# EAGLE design RPism_adapterboard_0V3 (EAGLE 6.4)
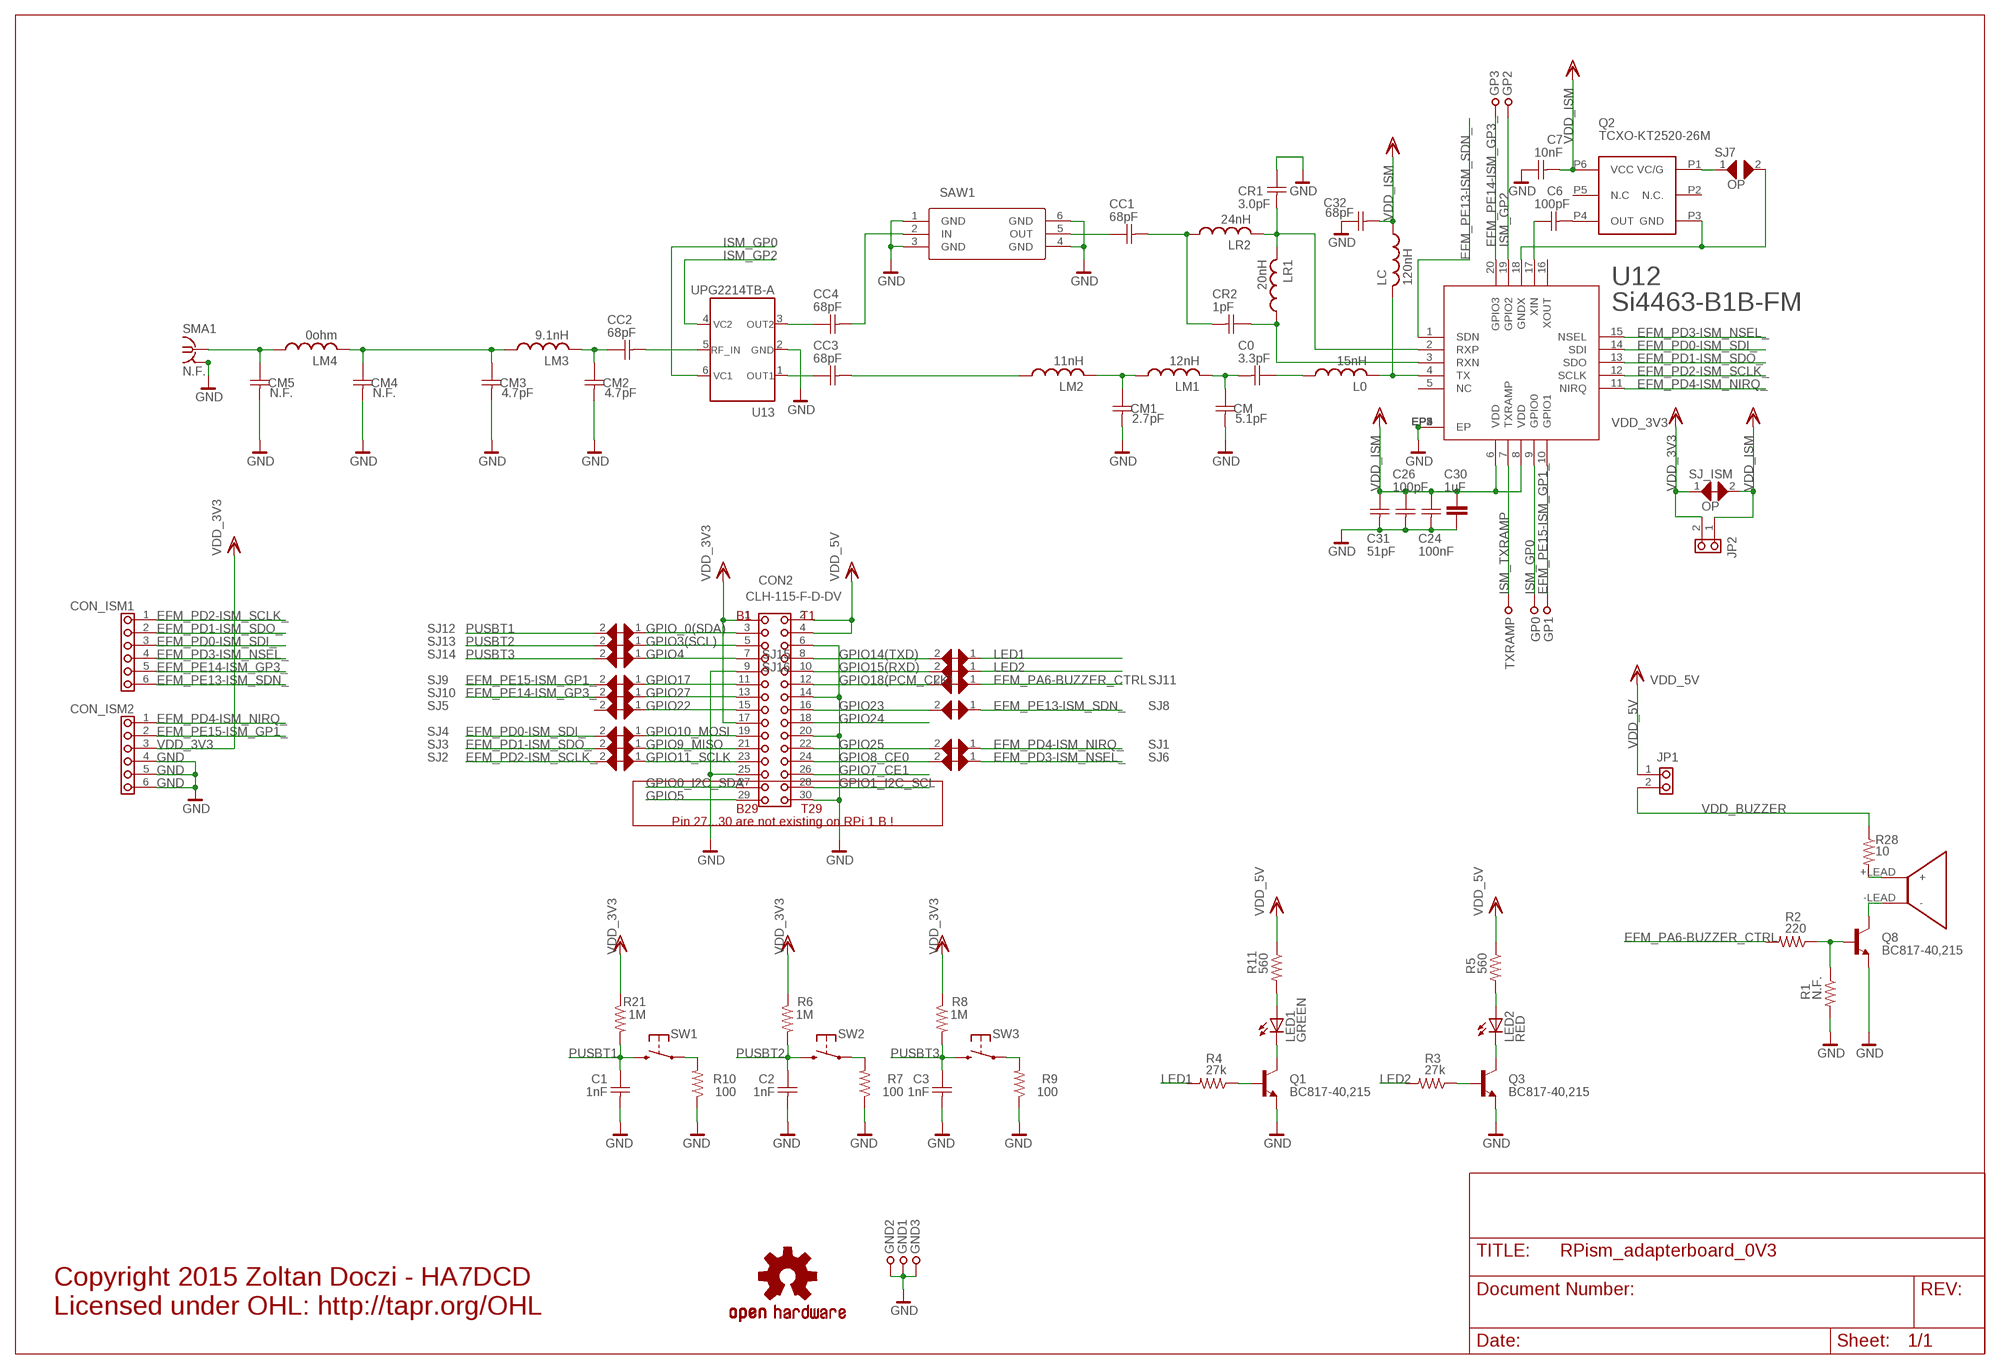
[diagram p0: schematic, sheet 1]

## Parts
BUZZ1  SMT-0540-S-R  [SMT-0540-S-R]
C0  3.3pF  CAP_GRM15  [CAPC1005X60N]
C1  1nF  CAP_GRM15  [CAPC1005X60N]
C2  1nF  CAP_GRM15  [CAPC1005X60N]
C3  1nF  CAP_GRM15  [CAPC1005X60N]
C6  100pF  CAP_GRM15  [CAPC1005X60N]
C7  10nF  CAP_GRM15  [CAPC1005X60N]
C24  100nF  CAP_GRM15  [CAPC1005X60N]
C26  100pF  CAP_GRM15  [CAPC1005X60N]
C30  1uF  CAP-SMD0603  [0603]
C31  51pF  CAP_GRM15  [CAPC1005X60N]
C32  68pF  CAP_GRM15  [CAPC1005X60N]
CC1  68pF  CAP_GRM15  [CAPC1005X60N]
CC2  68pF  CAP_GRM15  [CAPC1005X60N]
CC3  68pF  CAP_GRM15  [CAPC1005X60N]
CC4  68pF  CAP_GRM15  [CAPC1005X60N]
CM  5.1pF  CAP_GRM15  [CAPC1005X60N]
CM1  2.7pF  CAP_GRM15  [CAPC1005X60N]
CM2  4.7pF  CAP_GRM15  [CAPC1005X60N]
CM3  4.7pF  CAP_GRM15  [CAPC1005X60N]
CM4  N.F.  CAP_GRM15  [CAPC1005X60N]
CM5  N.F.  CAP_GRM15  [CAPC1005X60N]
CON2  CLH-115-F-D-DV  PINHD-2X15_SMD2X15  [2X15_SMT_CROSSPCB_ASSYM]
CON_ISM1  MALE__PIN6S-2MM  PIN6S-2MM  [PIN6S_2MM]
CON_ISM2  FEMALE__PIN6S-2MM  PIN6S-2MM  [PIN6S_2MM]
CR1  3.0pF  CAP_GRM15  [CAPC1005X60N]
CR2  1pF  CAP_GRM15  [CAPC1005X60N]
GND1  TESTPOINT39MIL  [TESTPOINT1,0]
GND2  TESTPOINT39MIL  [TESTPOINT1,0]
GND3  TESTPOINT39MIL  [TESTPOINT1,0]
GP0  TESTPOINT20MIL  [TESTPOINT0,5]
GP1  TESTPOINT20MIL  [TESTPOINT0,5]
GP2  TESTPOINT20MIL  [TESTPOINT0,5]
GP3  TESTPOINT20MIL  [TESTPOINT0,5]
JP1  JUMPER2  [PIN2-1R]
JP2  N.F.  JUMPER2  [PIN2-1R]
L0  15nH  INDUCT_SMD  [0402-INDUCT]
LC  120nH  INDUCT_SMD  [0402-INDUCT]
LED1  GREEN  LED0603  [LED-0603]
LED2  RED  LED0603  [LED-0603]
LM1  12nH  INDUCT_SMD  [0402-INDUCT]
LM2  11nH  INDUCT_SMD  [0402-INDUCT]
LM3  9.1nH  INDUCT_SMD  [0402-INDUCT]
LM4  0ohm  INDUCT_SMD  [0402-INDUCT]
LR1  20nH  INDUCT_SMD  [0402-INDUCT]
LR2  24nH  INDUCT_SMD  [0402-INDUCT]
Q1  BC817-40,215  BC817-16LT1SMD  [SOT23-BEC]
Q2  TCXO-KT2520-26M  [TCXO_2.5X2MM]
Q3  BC817-40,215  BC817-16LT1SMD  [SOT23-BEC]
Q8  BC817-40,215  BC817-16LT1SMD  [SOT23-BEC]
R1  N.F.  R-US_R0402  [R0402]
R2  220  R-US_R0402  [R0402]
R3  27k  R-US_R0402  [R0402]
R4  27k  R-US_R0402  [R0402]
R5  560  R-US_R0402  [R0402]
R6  1M  R-US_R0402  [R0402]
R7  100  R-US_R0402  [R0402]
R8  1M  R-US_R0402  [R0402]
R9  100  R-US_R0402  [R0402]
R10  100  R-US_R0402  [R0402]
R11  560  R-US_R0402  [R0402]
R21  1M  R-US_R0402  [R0402]
R28  10  R-US_R0402  [R0402]
SAW1  SAW_EPCOS_B3725  [DCC6C]
SJ1  JUMPER_SMD_MICRO_SHORT  [JUMPER_SMD_MICRO_SHORT]
SJ2  JUMPER_SMD_MICRO_SHORT  [JUMPER_SMD_MICRO_SHORT]
SJ3  JUMPER_SMD_MICRO_SHORT  [JUMPER_SMD_MICRO_SHORT]
SJ4  JUMPER_SMD_MICRO_SHORT  [JUMPER_SMD_MICRO_SHORT]
SJ5  JUMPER_SMD_MICRO_SHORT  [JUMPER_SMD_MICRO_SHORT]
SJ6  JUMPER_SMD_MICRO_SHORT  [JUMPER_SMD_MICRO_SHORT]
SJ7  OP  JUMPER_SMD_MICROOPEN  [JUMPER_SMD_MICRO]
SJ8  JUMPER_SMD_MICRO_SHORT  [JUMPER_SMD_MICRO_SHORT]
SJ9  JUMPER_SMD_MICRO_SHORT  [JUMPER_SMD_MICRO_SHORT]
SJ10  JUMPER_SMD_MICRO_SHORT  [JUMPER_SMD_MICRO_SHORT]
SJ11  JUMPER_SMD_MICRO_SHORT  [JUMPER_SMD_MICRO_SHORT]
SJ12  JUMPER_SMD_MICRO_SHORT  [JUMPER_SMD_MICRO_SHORT]
SJ13  JUMPER_SMD_MICRO_SHORT  [JUMPER_SMD_MICRO_SHORT]
SJ14  JUMPER_SMD_MICRO_SHORT  [JUMPER_SMD_MICRO_SHORT]
SJ15  JUMPER_SMD_MICRO_SHORT  [JUMPER_SMD_MICRO_SHORT]
SJ16  JUMPER_SMD_MICRO_SHORT  [JUMPER_SMD_MICRO_SHORT]
SJ_ISM  OP  JUMPER_SMD_MICRO_SHORT  [JUMPER_SMD_MICRO_SHORT]
SMA1  N.F.  SMAVERTICAL  [BU-SMA-V]
SW1  DTSM_32N  PUSHBUTTON1  [DTSM_32N]
SW2  DTSM_32N  PUSHBUTTON1  [DTSM_32N]
SW3  DTSM_32N  PUSHBUTTON1  [DTSM_32N]
TXRAMP  TESTPOINT20MIL  [TESTPOINT0,5]
U12  Si4463-B1B-FM  SI4463  [QFN-20_PRO2_VERIFIED]
U13  UPG2214TB-A  UPG2214TB6SM  [6-PIN_SUPER_MINIMOLD]
U$15  OSHW-LOGOL  [OSHW-LOGO-L]

## Nets
EFM_PA6-BUZZER_CTRL: R2.2 SJ11.1
EFM_PD0-ISM_SDI_: CON_ISM1.3 SJ4.2 U12.14(SDI)
EFM_PD1-ISM_SDO_: CON_ISM1.2 SJ3.2 U12.13(SDO)
EFM_PD2-ISM_SCLK_: CON_ISM1.1 SJ2.2 U12.12(SCLK)
EFM_PD3-ISM_NSEL_: CON_ISM1.4 SJ6.1 U12.15(NSEL)
EFM_PD4-ISM_NIRQ_: CON_ISM2.1 SJ1.1 U12.11(NIRQ)
EFM_PE13-ISM_SDN_: CON_ISM1.6 SJ8.1 U12.1(SDN)
EFM_PE14-ISM_GP3_: CON_ISM1.5 GP3.1 SJ10.2 U12.20(GPIO3)
EFM_PE15-ISM_GP1_: CON_ISM2.2 GP1.1 SJ9.2 U12.10(GPIO1)
GND: C1.2(C2) C2.2(C2) C3.2(C2) C7.1(C1) C24.2(C2) C26.2(C2) C30.1 C31.2(C2) C32.1(C1) CM1.2(C2) CM2.2(C2) CM3.2(C2) CM4.2(C2) CM5.2(C2) CM.2(C2) CON2.6 CON2.9 CON2.14 CON2.20 CON2.25 CON2.30 CON_ISM2.4 CON_ISM2.5 CON_ISM2.6 CR1.1(C1) GND1.1 GND2.1 GND3.1 Q1.E Q3.E Q8.E R1.2 R7.1 R9.1 R10.1 SAW1.1(GND) SAW1.3(GND) SAW1.4(GND) SAW1.6(GND) SMA1.2 SMA1.3 SMA1.4 SMA1.5 U12.EP0(EP) U12.EP1(EP) U12.EP2(EP) U12.EP3(EP) U12.EP4(EP) U12.EP5(EP) U13.2
GPIO0_I2C_SDA: CON2.27
GPIO1_I2C_SCL: CON2.28
GPIO3(SCL): CON2.5 SJ13.1
GPIO4: CON2.7 SJ14.1
GPIO5: CON2.29
GPIO7_CE1: CON2.26
GPIO8_CE0: CON2.24 SJ6.2
GPIO9_MISO: CON2.21 SJ3.1
GPIO10_MOSI: CON2.19 SJ4.1
GPIO11_SCLK: CON2.23 SJ2.1
GPIO14(TXD): CON2.8 SJ15.2
GPIO15(RXD): CON2.10 SJ16.2
GPIO17: CON2.11 SJ9.1
GPIO18(PCM_CLK): CON2.12 SJ11.2
GPIO22: CON2.15 SJ5.1
GPIO23: CON2.16 SJ8.2
GPIO24: CON2.18
GPIO25: CON2.22 SJ1.2
GPIO27: CON2.13 SJ10.1
GPIO_0(SDA): CON2.3 SJ12.1
ISM_GP0: GP0.1 U12.9(GPIO0) U13.6
ISM_GP2: GP2.1 U12.19(GPIO2) U13.4
ISM_TXRAMP: TXRAMP.1 U12.7(TXRAMP)
LED1: R4.2 SJ15.1
LED2: R3.2 SJ16.1
N$1: Q1.B R4.1
N$2: LED1.C Q1.C
N$3: LED1.A R11.2
N$4: LED2.C Q3.C
N$5: LED2.A R5.2
N$6: Q3.B R3.1
N$7: R7.2 SW2.1
N$8: C6.1(C1) U12.17(XIN)
N$9: R9.2 SW3.1
N$13: C6.2(C2) Q2.P4(OUT)
N$19: R10.2 SW1.1
N$45: BUZZ1.+LEAD(+) R28.2
N$46: BUZZ1.-LEAD(-) Q8.C
N$52: Q8.B R1.1 R2.1
N$60: CC1.1(C1) SAW1.5(OUT)
N$62: Q2.P1(VC/G) SJ7.1
N$63: L0.2 LC.2 U12.4(TX)
N$64: C0.1(C1) L0.1
N$65: C0.2(C2) CM.1(C1) LM1.2
N$66: CM1.1(C1) LM1.1 LM2.2
N$67: CC3.2(C2) LM2.1
N$68: CC3.1(C1) U13.1
N$70: CC2.2(C2) U13.5
N$71: CR2.1(C1) LR1.1 U12.3(RXN)
N$72: CR1.2(C2) LR1.2 LR2.2 U12.2(RXP)
N$75: Q2.P3(GND) SJ7.2 U12.18(GNDX)
N$76: CC1.2(C2) CR2.2(C2) LR2.1
N$78: CC4.2(C2) SAW1.2(IN)
N$79: CC4.1(C1) U13.3
PUSBT1: C1.1(C1) R21.2 SJ12.2 SW1.2
PUSBT2: C2.1(C1) R6.2 SJ13.2 SW2.2
PUSBT3: C3.1(C1) R8.2 SJ14.2 SW3.2
RF3: CM5.1(C1) LM4.1 SMA1.1
RF10: CC2.1(C1) CM2.1(C1) LM3.2
RF12: CM3.1(C1) CM4.1(C1) LM3.1 LM4.2
VDD_3V3: CON2.1 CON2.17 CON_ISM2.3 JP2.2(B) R6.1 R8.1 R21.1 SJ_ISM.1
VDD_5V: CON2.2 CON2.4 JP1.1(A) R5.1 R11.1
VDD_BUZZER: JP1.2(B) R28.1
VDD_ISM: C7.2(C2) C24.1(C1) C26.1(C1) C30.2 C31.1(C1) C32.2(C2) JP2.1(A) LC.1 Q2.P6(VCC) SJ_ISM.2 U12.6(VDD) U12.8(VDD)
Unconnected: Q2.P2(N.C.) Q2.P5(N.C) SJ5.2 U12.5(NC) U12.16(XOUT)

## Notes on the sheet
- Pin 27...30 are not existing on RPi 1 B !
- Copyright 2015 Zoltan Doczi - HA7DCD
  Licensed under OHL: http://tapr.org/OHL

## Library data of the parts
BUZZ1 = dzo:SMT-0540-S-R: BUZZER MAGNETIC 3V 5MM SMD; DISTRI: Digikey; DISTRINR: 668-1060-1-ND; PARTNR: PUI Audio, Inc.
C0 C1-C3 C6 C7 C24 C26 C31 C32 CC1-CC4 CM CM1-CM5 CR1 CR2 = dzo:CAP_GRM15: Murata GRM15 series 0402 size capacitor; MURATA: GRM15 series
C30 = lve_modositott:CAP-SMD
CON2 = dzo:PINHD-2X15_SMD: SAMTEC CLH-115-F-D-DV Board-To-Board Connector, CLH Series, Surface Mount, Receptacle, 30, 2.54 mm, Gold Plated Contacts; DISTRI: Farnell; DISTRINR: 1930662; PARTNR: CLH-115-F-D-DV
CON_ISM1 CON_ISM2 = dzo:PIN6S
GND1-GND3 = lve_modositott:TESTPOINT
GP0 GP1-GP3 TXRAMP = dzo:TESTPOINT
JP1 JP2 = dzo:JUMPER2
L0 = dzo:INDUCT_SMD: smd inductor; PARTNR: LQW15AN15NJ00; VENDOR: Murata
LC = dzo:INDUCT_SMD: smd inductor; PARTNR: LQW15ANR12J00; VENDOR: Murata
LED1 LED2 = dzo:LED: LEDs Standard schematic elements and footprints for 5mm, 3mm, 1206, and 0603 sized LEDs. 5mm - Spark Fun Electronics SKU : COM-00529 (and others)
LM1 LM4 = dzo:INDUCT_SMD: smd inductor; PARTNR: LQW15AN12NJ00; VENDOR: Murata
LM2 = dzo:INDUCT_SMD: smd inductor; PARTNR: LQW15AN11NJ00; VENDOR: Murata
LM3 = dzo:INDUCT_SMD: smd inductor; PARTNR: LQW15AN9N1J00; VENDOR: Murata
LR1 = dzo:INDUCT_SMD: smd inductor; PARTNR: LQW15AN20NJ00D; VENDOR: Murata
LR2 = dzo:INDUCT_SMD: smd inductor; PARTNR: LQW15AN24NJ00D; VENDOR: Murata
Q1 Q3 Q8 = transistor-npn:BC817*: NPN Transistor
Q2 = dzo:TCXO-KT2520-26M: Temperature Compensated Crystal Oscillators (TCXO) Surface Mount Type TCXO (LSI Type) KT2520 Series; DISTRI: Mouser; DISTRINR: 581-KT2520F26ACW18T; PARTNR: KT2520F26000ACW18TAN; VENDOR: AVX-Kyocera
R1-R11 R21 R28 = resistor:R-US_: RESISTOR, American symbol
SAW1 = dzo:SAW_EPCOS_B3725: 869MHz, BW=2MHz SAW filter; DISTRI: Mouser; DISTRINR: 871-B39871B3725U410; PARTNR: B39871B3725U410; VENDOR: Epcos
SJ1-SJ6 SJ8-SJ16 SJ_ISM = dzo:JUMPER_SMD_MICRO_SHORT
SJ7 = dzo:JUMPER_SMD_MICRO
SMA1 = dzo:SMA
SW1-SW3 = dzo:PUSHBUTTON1
U12 = dzo:SI4463: Sub GHz band RF Transceiver; DISTRI: Mouser; DISTRINR: 634-SI4463-B1B-FM; PARTNR: Si4463-B1B-FM; VENDOR: Silicon Labs
U13 = dzo:UPG2214TB: GaAs Integrated Circuit for L, S-Band SPDT Switch; DISTRI: Mouser; DISTRINR: 551-UPG2214TB-A; PARTNR: UPG2214TB-A; VENDOR: CEL
U$15 = Pinoccio:OSHW-LOGO: Open Source Hardware Logo This logo indicates the piece of hardware it is found on incorporates a OSHW license and/or adheres to the definition of open source hardware found here: http://freedomdefined.org/OSHW

## Board
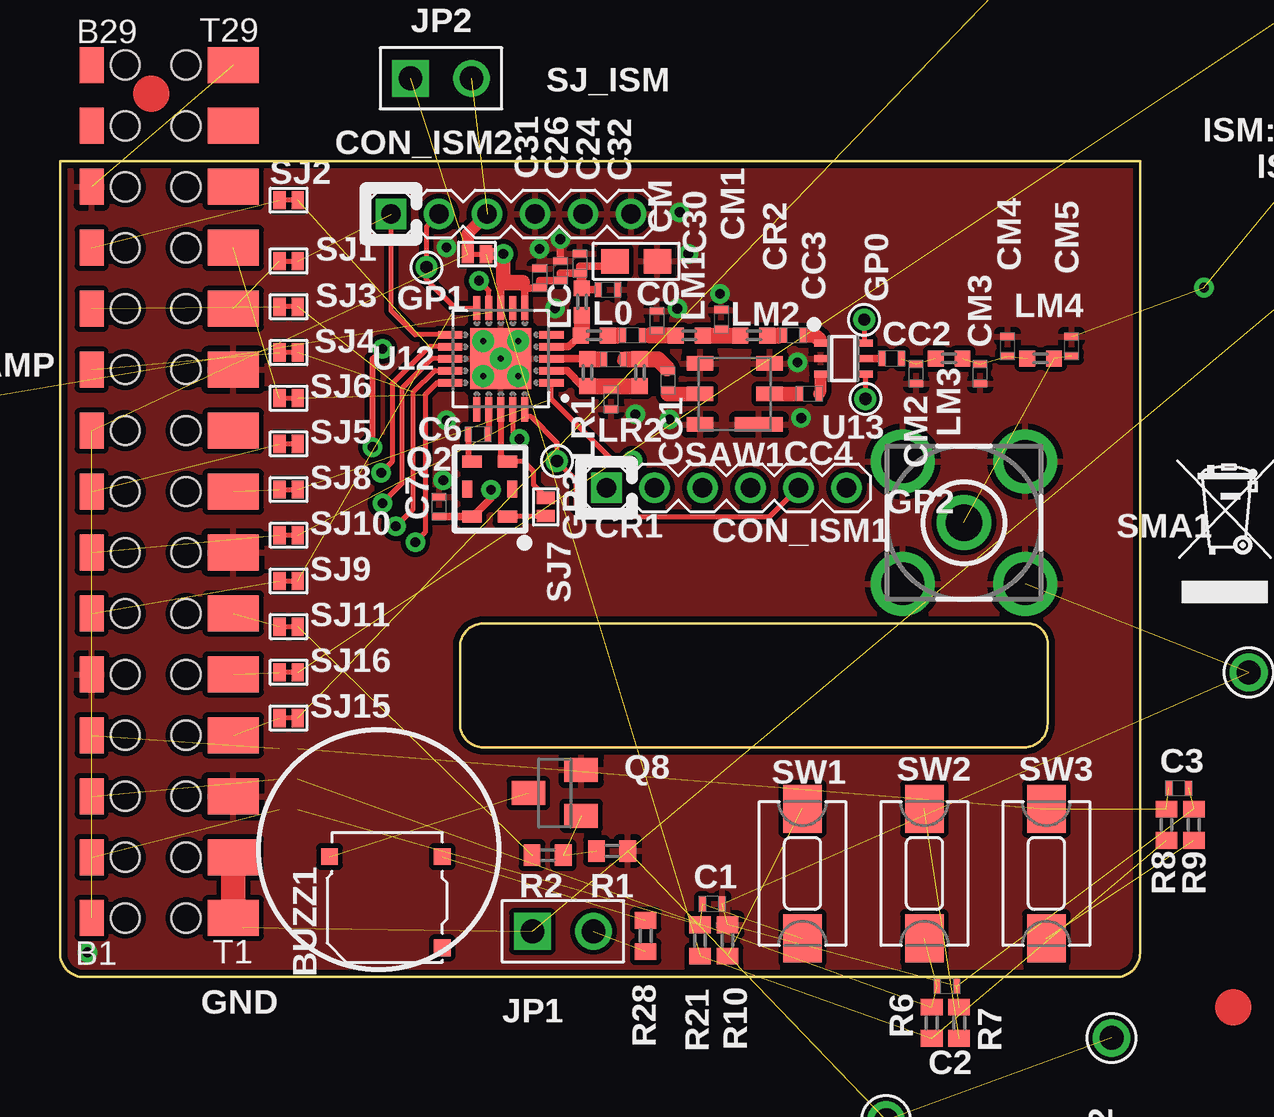
[diagram p1: board, top side]
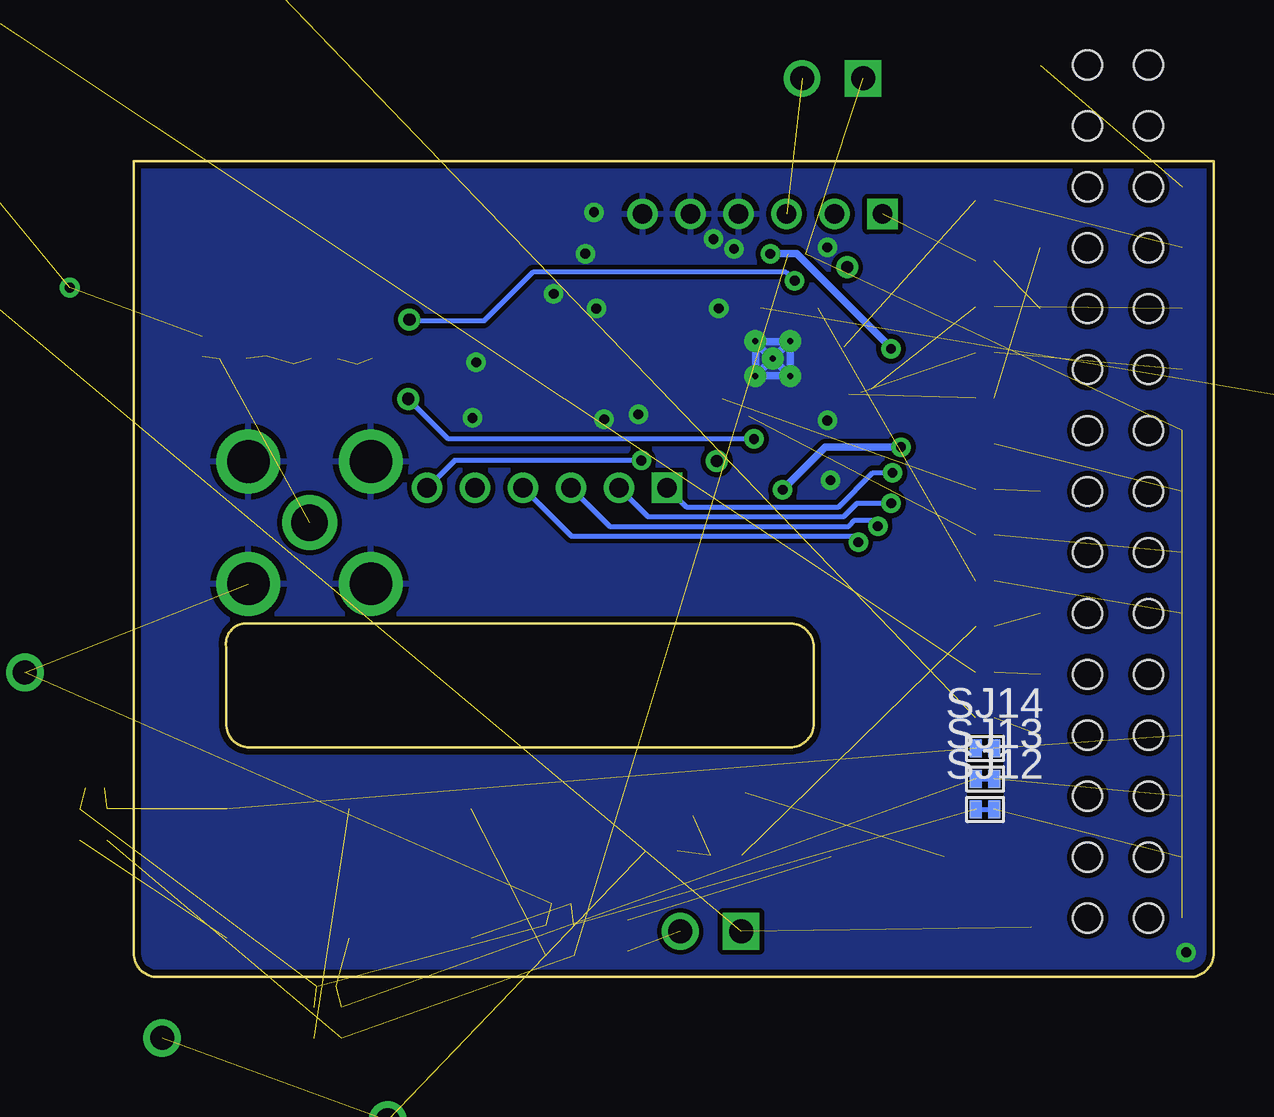
[diagram p2: board, bottom side, seen from below]

Size 45 x 34 mm. Coordinates in mm from the lower left corner, seen from the top.
Outline: 40,34 0,34 0,1 arc90 1,0 44,0 arc90 45,1 45,34 40,34
Outline: 17.65,14.74 40.42,14.74 arc-90 41.15,13.76 41.15,10.55 arc-90 40.17,9.57 17.65,9.57 arc-90 16.67,10.55 16.67,13.76 arc-90 17.65,14.74
Copper layers (1*16): Top 0.0356mm / dielectric 1.5mm / Bottom 0.0356mm
Design rules "default_INTEGRATION *": minimum track width 6mil, minimum drill 9mil, track to track 8mil, track to pad 6mil, pad to pad 6mil, via to via 8mil, smd to smd 0mil, copper to edge 10mil, drill to drill 8mil, minimum pad ring 7mil, minimum via ring 8mil, stop-mask expansion 0mil, vias tented up to drill 24mil, thermal gap 10mil

### Footprints (pad centres in the part's own frame; a part is rotated, then mirrored left to right if it is on the bottom)
SMT-0540-S-R = smd 0.7 x 0.7: +LEAD 0,0; -LEAD 0,4.7; DUMMY -3.8,0
CAPC1005X60N = smd 0.305 x 0.61: 1 -0.406,0; 2 0.406,0
0603 = smd 1.143 x 1.016: 1 -0.889,0; 2 0.889,0
2X15_SMT_CROSSPCB_ASSYM = smd 1.5 x 1: 1 -15.21,2.7; 3 -12.67,2.7; 5 -10.13,2.7; 7 -7.59,2.7; 9 -5.05,2.7; 11 -2.51,2.7; 13 0.03,2.7; 15 2.57,2.7; 17 5.11,2.7; 19 7.65,2.7; 21 10.19,2.7; 23 12.73,2.7; 25 15.27,2.7; 27 17.81,2.7; 29 20.35,2.7 | smd 1.5 x 2.13: 2 -15.21,-3.205; 4 -12.67,-3.205; 6 -10.13,-3.205; 8 -7.59,-3.205; 10 -5.05,-3.205; 12 -2.51,-3.205; 14 0.03,-3.205; 16 2.57,-3.205; 18 5.11,-3.205; 20 7.65,-3.205; 22 10.19,-3.205; 24 12.73,-3.205; 26 15.27,-3.205; 28 17.81,-3.205; 30 20.35,-3.205 | hole 1.2: -15.21,1.3; -12.67,1.3; -10.13,1.3; -7.59,1.3; -5.05,1.3; -2.51,1.3; 0.03,1.3; -15.21,-1.24; -12.67,-1.24; -10.13,-1.24; -7.59,-1.24; -5.05,-1.24; -2.51,-1.24; 0.03,-1.24; 2.57,-1.24; 5.11,-1.24; 2.57,1.3; 5.11,1.3; 7.65,-1.24; 10.19,-1.24; 12.73,-1.24; 15.27,-1.24; 17.81,-1.24; 20.35,-1.24; 7.65,1.3; 10.19,1.3; 12.73,1.3; 15.27,1.3; 17.81,1.3; 20.35,1.3
PIN6S_2MM = drill 0.813 pad 1.27 square: 1 0,0 | drill 0.813 pad 1.27: 2 2,0; 3 4,0; 4 6,0; 5 8,0; 6 10,0
TESTPOINT1,0 = drill 1 pad 1.575: 1 0,0
TESTPOINT0,5 = drill 0.508 pad 0.914: 1 0,0
PIN2-1R = drill 0.991 pad 1.524 square: 1 0,0 | drill 0.991 pad 1.524: 2 2.54,0
0402-INDUCT = smd 0.66 x 0.66: 1 -0.539,0; 2 0.579,0
LED-0603 = smd 0.8 x 0.8: A 0,-0.8; C 0,0.8
SOT23-BEC = smd 1 x 1.4: B -0.95,-1.1; C 0,1.1; E 0.95,-1.1
TCXO_2.5X2MM = smd 0.5 x 0.825: P1 -1.15,-0.738; P3 1.15,-0.738; P4 1.15,0.738; P6 -1.15,0.738 | smd 0.7 x 0.43: P2 0,-0.935; P5 0,0.935
R0402 = smd 0.7 x 0.9: 1 -0.65,0; 2 0.65,0
DCC6C = smd 0.6 x 2: 1 -1.27,-1 | smd 0.6 x 1.1: 2 0,-1.45; 3 1.27,-1.45; 4 1.27,1.45; 5 0,1.45; 6 -1.27,1.45
JUMPER_SMD_MICRO_SHORT = smd 0.508 x 0.762: 1 -0.381,0; 2 0.381,0
JUMPER_SMD_MICRO = smd 0.508 x 0.762: 1 -0.381,0; 2 0.381,0
BU-SMA-V = drill 1.524 pad 2.286: 1 0,0 | drill 1.778 pad 2.667: 2 -2.55,2.55; 3 2.55,2.55; 4 2.55,-2.55; 5 -2.55,-2.55
DTSM_32N = smd 2 x 1.6: 1 -2.7,0; 2 2.7,0
QFN-20_PRO2_VERIFIED = smd 1.016 x 0.305: 1 -2.108,1; 2 -2.108,0.5; 3 -2.108,0; 4 -2.108,-0.5; 5 -2.108,-1; 11 2.108,-1; 12 2.108,-0.5; 13 2.108,0; 14 2.108,0.5; 15 2.108,1 | smd 0.305 x 1.016: 6 -1,-2.108; 7 -0.5,-2.108; 8 0,-2.108; 9 0.5,-2.108; 10 1,-2.108; 16 1,2.108; 17 0.5,2.108; 18 0,2.108; 19 -0.5,2.108; 20 -1,2.108 | smd 2.55 x 2.55: EP0 0,0 | drill 0.25 pad 0.914: EP1 -0.723,0.727; EP2 0.727,0.727; EP3 -0.727,-0.727; EP4 0.727,-0.727; EP5 0,0
6-PIN_SUPER_MINIMOLD = smd 0.55 x 0.3: 1 -0.948,0.65; 2 -0.948,0; 3 -0.948,-0.65; 4 0.948,-0.65; 5 0.948,0; 6 0.948,0.65

### Placement (x,y rotation side)
BUZZ1  15.93,5.02 90 top
C0  23.85,26.74 0 top
C1  27.18,3.05 0 top
C2  36.96,-0.38 0 top
C3  46.61,7.87 0 top
C6  17.42,22.63 180 top
C7  15.8,19.6 270 top
C24  21.67,29.74 90 top
C26  20.85,29.43 90 top
C30  24.01,29.84 180 top
C31  19.99,29.13 90 top
C32  22.84,28.65 180 top
CC1  25.33,24.86 90 top
CC2  34.66,25.78 180 top
CC3  30.56,26.74 180 top
CC4  31.22,24.3 180 top
CM  24.87,27.35 90 top
CM1  27.56,27.4 90 top
CM2  35.67,25.15 270 top
CM3  38.34,25.15 270 top
CM4  39.48,26.29 90 top
CM5  42.15,26.29 90 top
CON2  4.01,17.67 90 top
CON_ISM1  22.77,20.39 0 top
CON_ISM2  13.79,31.81 0 top
CR1  22.96,24.08 90 top
CR2  23.07,25.75 0 top
GND1  34.42,-5.97 90 top  (outside the outline)
GND2  43.81,-2.54 0 top
GND3  49.53,12.7 180 top  (outside the outline)
GP0  33.51,27.4 90 top
GP1  15.27,29.59 180 top
GP2  33.56,24.1 0 top
GP3  20.71,21.51 0 top
JP1  19.68,1.91 0 top
JP2  14.61,37.47 0 top  (outside the outline)
L0  22.28,26.74 180 top
LC  21.74,28.17 270 top
LED1  56.8,57.23 0 top  (outside the outline)
LED2  64.42,43.27 0 top  (outside the outline)
LM1  26.24,26.74 180 top
LM2  28.93,26.74 180 top
LM3  37.07,25.78 180 top
LM4  40.88,25.78 180 top
LR1  21.97,25.22 270 top
LR2  24.16,25.22 270 top
Q1  56.87,62.15 180 top  (outside the outline)
Q2  17.91,20.34 90 top
Q3  59.34,45.17 0 top  (outside the outline)
Q8  20.61,7.67 90 top
R1  23,5.25 0 top
R2  20.32,5.08 180 top
R3  56.23,43.09 180 top  (outside the outline)
R4  59.98,63.59 0 top  (outside the outline)
R5  64.69,40.29 90 top  (outside the outline)
R6  36.32,-1.91 90 top
R7  37.47,-1.91 270 top
R8  46.1,6.35 90 top
R9  47.24,6.35 270 top
R10  27.81,1.52 270 top
R11  58.7,55.33 0 top  (outside the outline)
R21  26.67,1.52 90 top
R28  24.4,1.71 90 top
SAW1  28.12,24.3 90 top
SJ1  9.53,29.84 0 top
SJ2  9.53,32.38 180 top
SJ3  9.53,27.94 180 top
SJ4  9.53,26.04 180 top
SJ5  9.53,22.23 180 top
SJ6  9.53,24.13 0 top
SJ7  20.24,19.6 90 top
SJ8  9.53,20.32 0 top
SJ9  9.53,16.51 0 top
SJ10  9.53,18.41 0 top
SJ11  9.53,14.61 0 top
SJ12  9.53,6.99 0 bottom
SJ13  9.53,8.26 0 bottom
SJ14  9.53,9.53 0 bottom
SJ15  9.53,10.79 180 top
SJ16  9.53,12.7 180 top
SJ_ISM  17.37,30.13 0 top
SMA1  37.67,18.94 0 top
SW1  30.94,4.32 270 top
SW2  36.02,4.32 270 top
SW3  41.1,4.32 90 top
TXRAMP  -5.68,23.75 0 top  (outside the outline)
U12  18.37,25.77 180 top
U13  32.64,25.78 0 top
U$1  [FIDUCIAL]  54.31,29.26 0 top  (outside the outline)
U$15  40.01,-20.32 0 top  (outside the outline)
U$115  [FIDUCIAL]  3.81,36.83 0 top
U$116  [FIDUCIAL]  48.9,-1.27 0 top  (outside the outline)
U$142  [NON-DISPOSABLE]  48.57,19.48 0 top  (outside the outline)
U$143  [ROHS_CHINA]  56.7,21.34 0 top  (outside the outline)

### Tracks (layer width: path | path; a pad name or v marks a point on that pad's centre or on a via)
EFM_PA6-BUZZER_CTRL  (1 unrouted)
EFM_PD0-ISM_SDI_  (via drill 0.41)  (1 unrouted)
  Top 0.203: U12.14 16.25,25.29 15.62,25.29 14.7,24.38 14.7,19.5 v13.99,18.79
  Bottom 0.203: v13.99,18.79 14.25,19.04 14.96,19.04 15.21,18.79 25.16,18.79 CON_ISM1.3
EFM_PD1-ISM_SDO_  (via drill 0.41)  (1 unrouted)
  Top 0.203: U12.13 15.49,25.77 14.25,24.53 14.25,20.57 v13.43,19.75
  Bottom 0.203: v13.43,19.75 14.86,19.75 15.41,19.19 23.57,19.19 CON_ISM1.2
EFM_PD2-ISM_SCLK_  (via drill 0.41)  (1 unrouted)
  Top 0.203: U12.12 15.38,26.27 13.84,24.73 13.84,21.48 v13.38,21.02
  Bottom 0.203: v13.38,21.02 14.2,21.02 15.62,19.6 21.98,19.6 CON_ISM1.1
EFM_PD3-ISM_NSEL_  (via drill 0.41)  (1 unrouted)
  Top 0.203: U12.15 15.71,24.77 15.21,24.27 15.21,18.53 v14.81,18.13
  Bottom 0.203: v14.81,18.13 15.06,18.38 26.76,18.38 CON_ISM1.4
EFM_PD4-ISM_NIRQ_  (1 unrouted)
  Top 0.203: U12.11 14.79,26.77 13.79,27.77 CON_ISM2.1
EFM_PE13-ISM_SDN_  (via drill 0.41)  (1 unrouted)
  Top 0.203: 20.47,24.77 U12.1 20.48,24.09 23.04,21.53 v23.85,21.53
  Bottom 0.203: v23.85,21.53 31.63,21.53 CON_ISM1.6
EFM_PE14-ISM_GP3_  (1 unrouted)
  Top 0.203: U12.20 19.37,23.36 19.63,23.36 20.71,22.28 GP3.1 21.52,20.7 21.52,19.59 21.92,19.19 29.57,19.19 CON_ISM1.5
EFM_PE15-ISM_GP1_  (1 unrouted)
  Top 0.203: U12.10 16.47,27.88 15.27,29.08 GP1.1 15.27,31.28 CON_ISM2.2
GND  (via drill 0.41)  (13 unrouted)
  Top 0.305: C26.2 20.85,30.55 v20.84,30.76
  Bottom 0.305: U12.EP2 17.64,26.46 17.6,26.5 17.65,26.5 | 17.65,26.5 19.08,26.5 19.08,25.07 17.67,25.07 | 17.6,25.07 17.67,25.07 | 17.67,25.07 U12.EP0 18.4,25.77 19.13,26.5 | U12.EP1 17.65,26.5
  other vias: 1.14,1.03 15.97,20.7 26.18,30.15 19.98,30.35 25.72,27.86 27.5,28.47 30.73,25.63 20.62,27.87 47.66,28.74 16.1,30.41 16.1,23.2 23.97,23.45 30.88,23.3 25.4,23.25 25.82,31.88
  pour Top (rank 2): 45,34 45,0 0.01,0 0,34
  pour Bottom (rank 2): 45,34 45,0 0.01,0 0,34
GPIO3(SCL)  (1 unrouted)
GPIO4  (1 unrouted)
GPIO8_CE0  (1 unrouted)
GPIO9_MISO  (1 unrouted)
GPIO10_MOSI  (1 unrouted)
GPIO11_SCLK  (1 unrouted)
GPIO14(TXD)  (1 unrouted)
GPIO15(RXD)  (1 unrouted)
GPIO17  (1 unrouted)
GPIO18(PCM_CLK)  (1 unrouted)
GPIO22  (1 unrouted)
GPIO23  (1 unrouted)
GPIO25  (1 unrouted)
GPIO27  (1 unrouted)
GPIO_0(SDA)  (1 unrouted)
ISM_GP0  (via drill 0.41)
  Top 0.203: GP0.1 33.51,26.51 U13.6 | U12.9 17.87,28.61 v17.45,29.03
  Bottom 0.203: v17.45,29.03 17.81,29.38 28.38,29.38 30.41,27.35 33.41,27.35 GP0.1
ISM_GP2  (via drill 0.41)
  Top 0.203: U12.19 18.87,22.7 v19.15,22.43 | U13.4 33.57,25.12 33.57,24.3 33.56,24.29 GP2.1
  Bottom 0.203: v19.15,22.43 31.89,22.43 GP2.1
ISM_TXRAMP  (1 unrouted)
LED1  (1 unrouted)
LED2  (1 unrouted)
N$1  (1 unrouted)
N$2  (1 unrouted)
N$3  (1 unrouted)
N$4  (1 unrouted)
N$5  (1 unrouted)
N$6  (1 unrouted)
N$7  (1 unrouted)
N$8
  Top 0.254: U12.17 17.87,22.67 C6.1
N$9  (1 unrouted)
N$13
  Top 0.254: C6.2 17.01,21.65 Q2.P4
N$19  (1 unrouted)
N$45  (1 unrouted)
N$46  (1 unrouted)
N$52  (2 unrouted)
N$60
  Top 0.305: 25.85,24.3 25.48,24.3 CC1.1
  Top 0.61: SAW1.5 25.32,24.3 25.85,24.3
N$62
  Top 0.203: SJ7.1 19.96,19.19 Q2.P1
N$63
  Top 0.305: U12.4 21.18,26.27 L0.2
  Top 0.66: LC.2 21.75,26.8 L0.2
N$64
  Top 0.305: 23.26,26.74 23.21,26.79 C0.1
  Top 0.66: L0.1 23.01,26.74 23.26,26.74
N$65
  Top 0.305: C0.2 24.51,26.84 CM.1 24.77,26.79 24.58,26.74
  Top 0.66: LM1.2 25.45,26.74 24.58,26.74
N$66
  Top 0.305: LM1.1 27.31,26.79 CM1.1
  Top 0.66: LM1.1 LM2.2
N$67
  Top 0.305: CC3.2 29.66,26.74
  Top 0.66: LM2.1 29.66,26.74 29.97,26.74
N$68
  Top 0.305: CC3.1 30.98,26.79 31.14,26.74 | U13.1 31.79,26.49 31.44,26.74
  Top 0.61: 31.14,26.74 31.44,26.74 31.64,26.59
N$70
  Top 0.305: U13.5 34.06,25.78 CC2.2
N$71
  Top 0.305: U12.3 21.96,25.77 LR1.1 CR2.1
  Top 0.66: LR1.1 22.45,25.76
N$72
  Top 0.305: U12.2 21.13,25.27 21.77,24.64 LR1.2 22.13,24.48 CR1.2
  Top 0.66: LR1.2 LR2.2
N$75
  Top 0.203: 18.37,21.77 Q2.P3 18.66,21.48 19.33,21.48 19.73,21.07 19.73,20.51 20.24,20.01 SJ7.2
  Top 0.254: U12.18 18.37,21.77
N$76
  Top 0.305: CR2.2 23.37,25.67 23.57,25.75 | 25.29,25.37 25.19,25.4 CC1.2
  Top 0.66: 23.57,25.75 23.92,25.75 LR2.1 24.91,25.76 25.29,25.37
N$78
  Top 0.305: CC4.2 SAW1.2
  Top 0.61: SAW1.2 30.02,24.3 30.63,24.3
N$79
  Top 0.305: U13.3 31.8,25.13 31.7,24.91
  Top 0.508: CC4.1 31.7,24.43 31.7,24.91
PUSBT1  (3 unrouted)
PUSBT2  (3 unrouted)
PUSBT3  (3 unrouted)
RF3  (2 unrouted)
RF10  (2 unrouted)
RF12  (3 unrouted)
VDD_3V3  (6 unrouted)
  Top 0.508: SJ_ISM.1 16.99,31 CON_ISM2.3
VDD_5V  (3 unrouted)
  Top 0.508: 7.61,2.07 CON2.2
  Top 1.016: CON2.4 CON2.2
VDD_BUZZER  (1 unrouted)
VDD_ISM  (via drill 0.41)  (1 unrouted)
  Top 0.203: C7.2 17.19,19.19
  Top 0.254: 17.16,19.18 Q2.P6 | v13.03,22.09 13.03,25.77 v13.44,26.18
  Top 0.305: U12.6 19.37,28.72 | 19.37,28.72 C31.1 19.99,29.03 C26.1 20.85,29.33 C24.1 21.66,29.64 22.68,29.64 22.79,30.04 C30.2 | U12.8 18.37,28.77 19.18,28.77 | 19.18,28.77 19.37,28.72 | C32.2 21.75,28.65 LC.1 | 19.28,28.98 19.28,28.88 19.18,28.77 | Q2.P6 C7.2 | 17.19,19.19 17.95,19.95 v17.95,20.31
  Top 0.406: LC.1 21.75,29.38 | 21.75,29.43 21.75,29.38 | 21.75,29.38 C24.1
  Top 0.508: v18.47,30.14 18.46,30.13 SJ_ISM.2
  Top 0.61: v18.47,30.14 18.47,28.98 19.28,28.98
  Bottom 0.305: v18.47,30.14 17.38,30.14 13.44,26.21 v13.44,26.18 | v17.95,20.31 16.18,22.09 v13.03,22.09

### Text on the board
Top: TOP
Bottom: BOTTOM
tPlace: ISM: Si4463-B1B-FM / ISM Rev.: 0V2 | GND | speaker, 10mm diameter / http://hu.farnell.com/kingstate/kdmg10008c-03/loudspeaker-micro-10mm/dp/1299880 | RPism